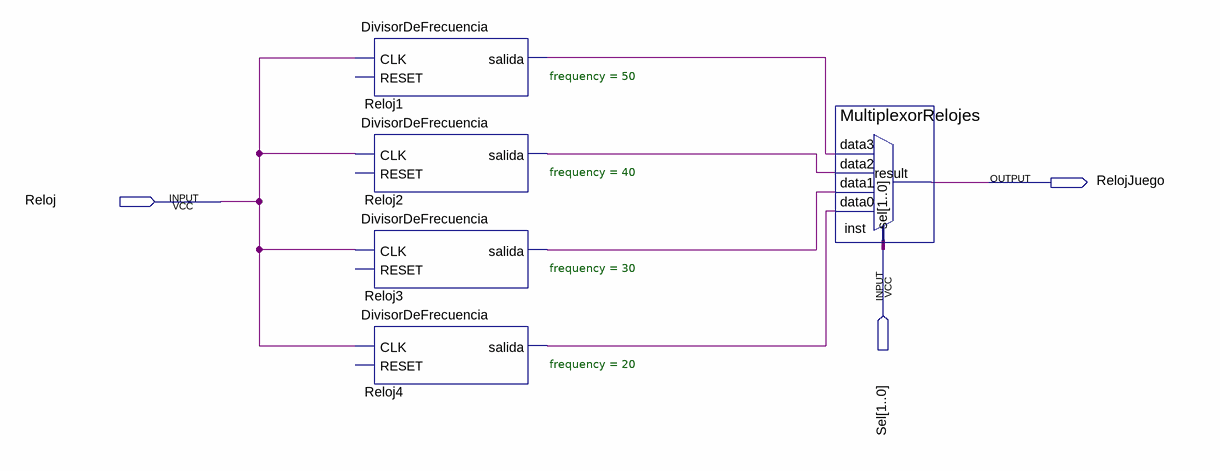
[diagram p0: schematic sheet]
// Quartus schematic GeneradorRelojJuego.bdf as structural Verilog: 5 symbols, 3 pins
module GeneradorRelojJuego (
  input  Reloj,
  input  [1:0] Sel,
  output RelojJuego
);

  wire Reloj1_salida, Reloj2_salida, Reloj3_salida, Reloj4_salida;

  DivisorDeFrecuencia #(.frequency(50)) Reloj1 (.CLK(Reloj), .salida(Reloj1_salida));  // open: RESET
  DivisorDeFrecuencia #(.frequency(40)) Reloj2 (.CLK(Reloj), .salida(Reloj2_salida));  // open: RESET
  DivisorDeFrecuencia #(.frequency(30)) Reloj3 (.CLK(Reloj), .salida(Reloj3_salida));  // open: RESET
  DivisorDeFrecuencia #(.frequency(20)) Reloj4 (.CLK(Reloj), .salida(Reloj4_salida));  // open: RESET
  MultiplexorRelojes inst (
    .data3(Reloj1_salida), .data2(Reloj2_salida), .data1(Reloj3_salida), .data0(Reloj4_salida), .sel(Sel),
    .result(RelojJuego));
endmodule
